# EAGLE schematic Main_DMB-4773-opto (EAGLE 6.5.0)

## Sheet 1 of 2
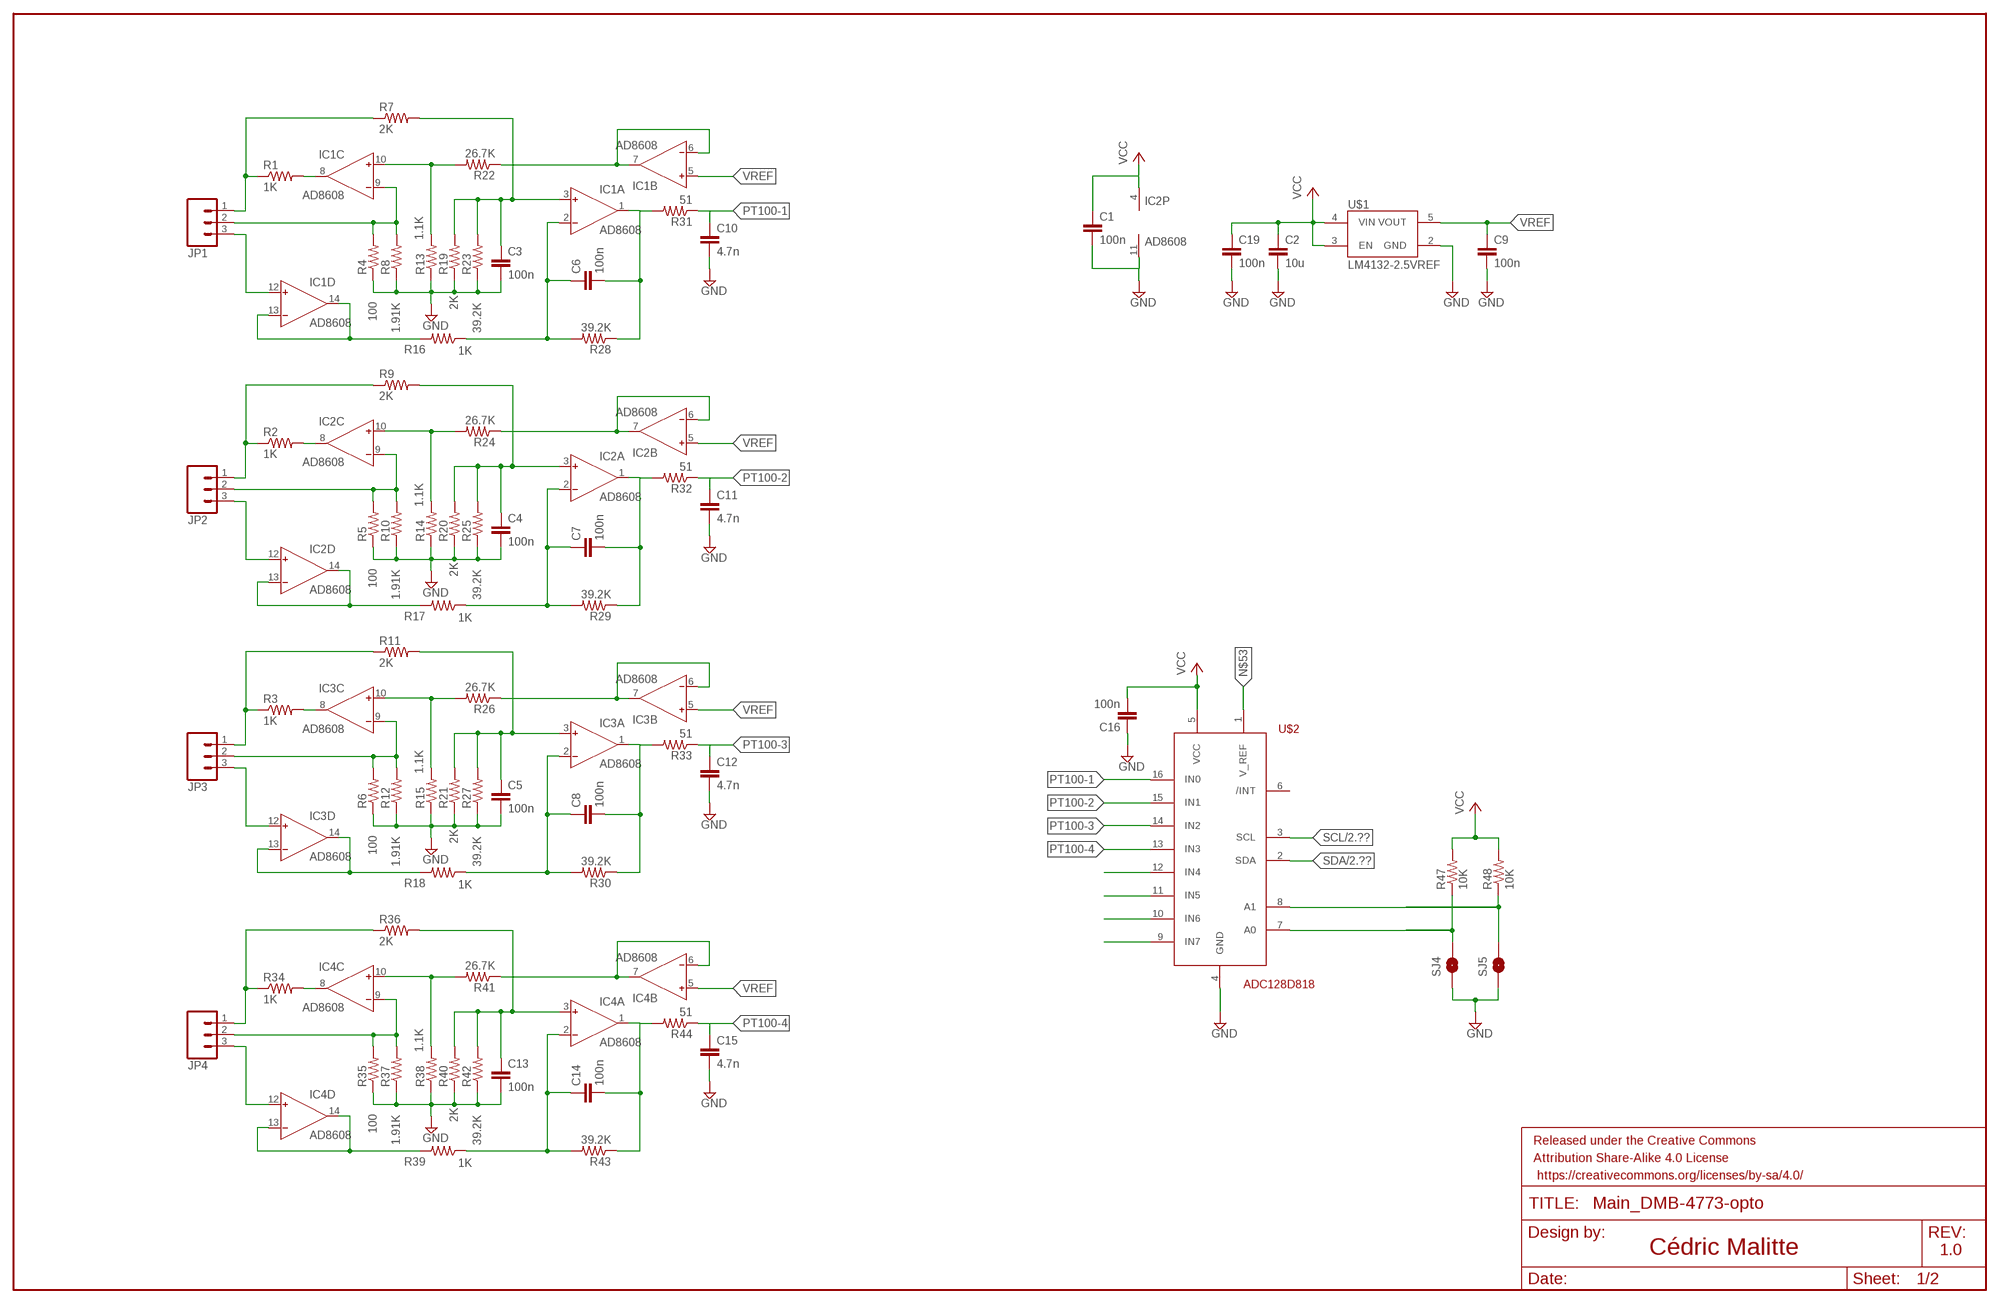
[diagram p0: schematic, sheet 1]

### Parts
C1  100n  CAP0805  [0805]
C2  10u  CAP0805  [0805]
C3  100n  CAP0805  [0805]
C4  100n  CAP0805  [0805]
C5  100n  CAP0805  [0805]
C6  100n  CAP0805  [0805]
C7  100n  CAP0805  [0805]
C8  100n  CAP0805  [0805]
C9  100n  CAP0805  [0805]
C10  4.7n  CAP0805  [0805]
C11  4.7n  CAP0805  [0805]
C12  4.7n  CAP0805  [0805]
C13  100n  CAP0805  [0805]
C14  100n  CAP0805  [0805]
C15  4.7n  CAP0805  [0805]
C16  100n  CAP0805  [0805]
C19  100n  CAP0805  [0805]
FRAME1  FRAME-LEDGER  [CREATIVE_COMMONS]
IC1  AD8608  AD8609R  [SO14]
IC2  AD8608  AD8609R  [SO14]
IC3  AD8608  AD8609R  [SO14]
IC4  AD8608  AD8609R  [SO14]
JP1  M03SCREW  [SCREWTERMINAL-3.5MM-3]
JP2  M03SCREW  [SCREWTERMINAL-3.5MM-3]
JP3  M03SCREW  [SCREWTERMINAL-3.5MM-3]
JP4  M03SCREW  [SCREWTERMINAL-3.5MM-3]
R1  1K  RESISTOR0805-RES  [0805]
R2  1K  RESISTOR0805-RES  [0805]
R3  1K  RESISTOR0805-RES  [0805]
R4  100  RESISTOR0805-RES  [0805]
R5  100  RESISTOR0805-RES  [0805]
R6  100  RESISTOR0805-RES  [0805]
R7  2K  RESISTOR0805-RES  [0805]
R8  1.91K  RESISTOR0805-RES  [0805]
R9  2K  RESISTOR0805-RES  [0805]
R10  1.91K  RESISTOR0805-RES  [0805]
R11  2K  RESISTOR0805-RES  [0805]
R12  1.91K  RESISTOR0805-RES  [0805]
R13  1.1K  RESISTOR0805-RES  [0805]
R14  1.1K  RESISTOR0805-RES  [0805]
R15  1.1K  RESISTOR0805-RES  [0805]
R16  1K  RESISTOR0805-RES  [0805]
R17  1K  RESISTOR0805-RES  [0805]
R18  1K  RESISTOR0805-RES  [0805]
R19  2K  RESISTOR0805-RES  [0805]
R20  2K  RESISTOR0805-RES  [0805]
R21  2K  RESISTOR0805-RES  [0805]
R22  26.7K  RESISTOR0805-RES  [0805]
R23  39.2K  RESISTOR0805-RES  [0805]
R24  26.7K  RESISTOR0805-RES  [0805]
R25  39.2K  RESISTOR0805-RES  [0805]
R26  26.7K  RESISTOR0805-RES  [0805]
R27  39.2K  RESISTOR0805-RES  [0805]
R28  39.2K  RESISTOR0805-RES  [0805]
R29  39.2K  RESISTOR0805-RES  [0805]
R30  39.2K  RESISTOR0805-RES  [0805]
R31  51  RESISTOR0805-RES  [0805]
R32  51  RESISTOR0805-RES  [0805]
R33  51  RESISTOR0805-RES  [0805]
R34  1K  RESISTOR0805-RES  [0805]
R35  100  RESISTOR0805-RES  [0805]
R36  2K  RESISTOR0805-RES  [0805]
R37  1.91K  RESISTOR0805-RES  [0805]
R38  1.1K  RESISTOR0805-RES  [0805]
R39  1K  RESISTOR0805-RES  [0805]
R40  2K  RESISTOR0805-RES  [0805]
R41  26.7K  RESISTOR0805-RES  [0805]
R42  39.2K  RESISTOR0805-RES  [0805]
R43  39.2K  RESISTOR0805-RES  [0805]
R44  51  RESISTOR0805-RES  [0805]
R47  10K  RESISTOR0805-RES  [0805]
R48  10K  RESISTOR0805-RES  [0805]
SJ4  SOLDERJUMPERNC  [SJ_2S]
SJ5  SOLDERJUMPERNC  [SJ_2S]
U$1  LM4132-2.5VREF  LM4128-2.5VREF  [SOT23-5]
U$2  ADC128D818  [SSOP16]

### Nets
GND: C1.2 C2.2 C3.2 C4.2 C5.2 C9.2 C10.2 C11.2 C12.2 C13.2 C15.2 C16.1 C19.2 IC2.11(P:V-) R4.1 R5.1 R6.1 R8.1 R10.1 R12.1 R13.1 R14.1 R15.1 R19.1 R20.1 R21.1 R23.1 R25.1 R27.1 R35.1 R37.1 R38.1 R40.1 R42.1 SJ4.1 SJ5.1 U$1.2(GND) U$2.4(GND) ; also sheet 2
N$1: IC2.12(D:IN+) JP2.3
N$2: IC2.13(D:IN-) IC2.14(D:OUT) R17.2
N$3: IC2.9(C:IN-) JP2.2 R5.2 R10.2
N$4: JP2.1 R2.1 R9.1
N$5: IC2.8(C:OUT) R2.2
N$6: IC3.12(D:IN+) JP3.3
N$7: IC3.13(D:IN-) IC3.14(D:OUT) R18.2
N$8: IC2.10(C:IN+) R14.2 R24.2
N$9: C4.1 IC2.3(A:IN+) R9.2 R20.2 R25.2
N$10: IC2.6(B:IN-) IC2.7(B:OUT) R24.1
N$11: IC3.9(C:IN-) JP3.2 R6.2 R12.2
N$12: JP3.1 R3.1 R11.1
N$13: C7.1 IC2.2(A:IN-) R17.1 R29.2
N$14: C7.2 IC2.1(A:OUT) R29.1 R32.2
N$15: IC3.8(C:OUT) R3.2
N$16: IC3.10(C:IN+) R15.2 R26.2
N$17: C5.1 IC3.3(A:IN+) R11.2 R21.2 R27.2
N$18: IC3.6(B:IN-) IC3.7(B:OUT) R26.1
N$19: C8.1 IC3.2(A:IN-) R18.1 R30.2
N$20: C8.2 IC3.1(A:OUT) R30.1 R33.2
N$21: IC4.12(D:IN+) JP4.3
N$22: IC4.13(D:IN-) IC4.14(D:OUT) R39.2
N$23: IC4.9(C:IN-) JP4.2 R35.2 R37.2
N$24: JP4.1 R34.1 R36.1
N$25: IC4.8(C:OUT) R34.2
N$26: IC4.10(C:IN+) R38.2 R41.2
N$27: C13.1 IC4.3(A:IN+) R36.2 R40.2 R42.2
N$28: IC4.6(B:IN-) IC4.7(B:OUT) R41.1
N$29: C14.1 IC4.2(A:IN-) R39.1 R43.2
N$30: C14.2 IC4.1(A:OUT) R43.1 R44.2
N$31: IC1.12(D:IN+) JP1.3
N$32: IC1.13(D:IN-) IC1.14(D:OUT) R16.2
N$33: IC1.9(C:IN-) JP1.2 R4.2 R8.2
N$34: JP1.1 R1.1 R7.1
N$35: IC1.8(C:OUT) R1.2
N$36: IC1.10(C:IN+) R13.2 R22.2
N$37: C3.1 IC1.3(A:IN+) R7.2 R19.2 R23.2
N$38: IC1.6(B:IN-) IC1.7(B:OUT) R22.1
N$39: C6.1 IC1.2(A:IN-) R16.1 R28.2
N$40: C6.2 IC1.1(A:OUT) R28.1 R31.2
N$45: U$2.12(IN4)
N$46: U$2.11(IN5)
N$47: U$2.10(IN6)
N$48: U$2.9(IN7)
N$51: R48.1 SJ5.2 U$2.8(A1)
N$52: R47.1 SJ4.2 U$2.7(A0)
N$53: U$2.1(V_REF)
PT100-1: C10.1 R31.1 U$2.16(IN0)
PT100-2: C11.1 R32.1 U$2.15(IN1)
PT100-3: C12.1 R33.1 U$2.14(IN2)
PT100-4: C15.1 R44.1 U$2.13(IN3)
SCL: U$2.3(SCL) ; also sheet 2
SDA: U$2.2(SDA) ; also sheet 2
VCC: C1.1 C2.1 C16.2 C19.1 IC2.4(P:V+) R47.2 R48.2 U$1.3(EN) U$1.4(VIN) U$2.5(VCC) ; also sheet 2
VREF: C9.1 IC1.5(B:IN+) IC2.5(B:IN+) IC3.5(B:IN+) IC4.5(B:IN+) U$1.5(VOUT)
Unconnected: U$2.6(/INT)

### Notes on the sheet
- Cédric Malitte | 1.0

## Sheet 2 of 2
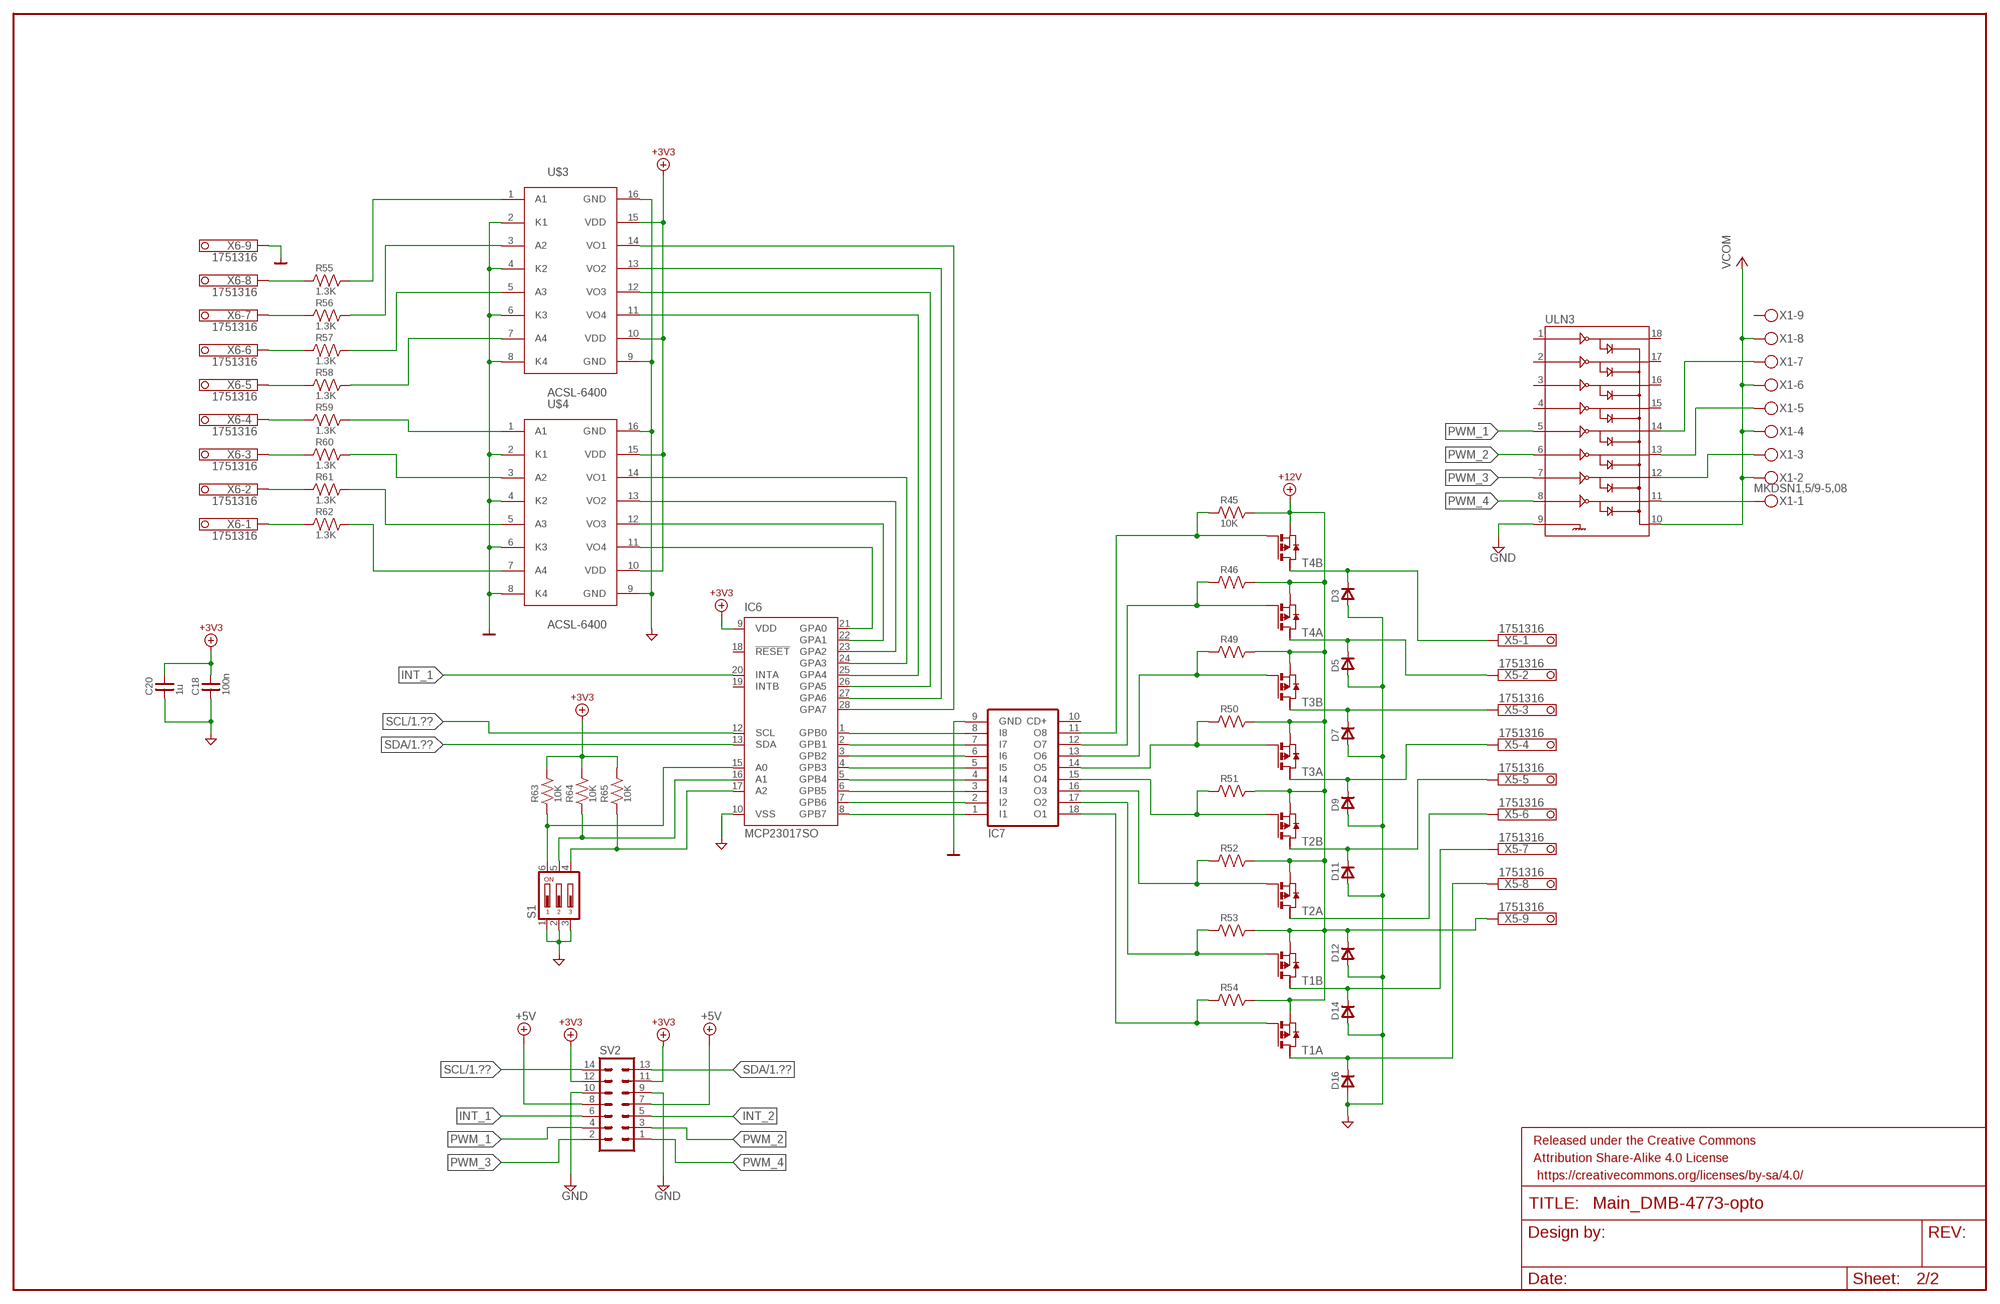
[diagram p1: schematic, sheet 2]

### Parts
C18  100n  C0805  [C0805]
C20  1u  C0805  [C0805]
D3  DSMA  [DSMA]
D5  DSMA  [DSMA]
D7  DSMA  [DSMA]
D9  DSMA  [DSMA]
D11  DSMA  [DSMA]
D12  DSMA  [DSMA]
D14  DSMA  [DSMA]
D16  DSMA  [DSMA]
FRAME3  FRAME-LEDGER  [CREATIVE_COMMONS]
IC6  MCP23017SO  [SO28W]
IC7  ULN2803A  [DIL18]
R45  10K  RU0805  [R0805]
R46  RU0805  [R0805]
R49  RU0805  [R0805]
R50  RU0805  [R0805]
R51  RU0805  [R0805]
R52  RU0805  [R0805]
R53  RU0805  [R0805]
R54  RU0805  [R0805]
R55  1.3K  RU0805  [R0805]
R56  1.3K  RU0805  [R0805]
R57  1.3K  RU0805  [R0805]
R58  1.3K  RU0805  [R0805]
R59  1.3K  RU0805  [R0805]
R60  1.3K  RU0805  [R0805]
R61  1.3K  RU0805  [R0805]
R62  1.3K  RU0805  [R0805]
R63  10K  RU0805  [R0805]
R64  10K  RU0805  [R0805]
R65  10K  RU0805  [R0805]
S1  DIP03YL  [DIP03YL]
SV2  ML14  [ML14]
T1  PMOS2SO8  [SO8]
T2  PMOS2SO8  [SO8]
T3  PMOS2SO8  [SO8]
T4  PMOS2SO8  [SO8]
U$3  ACSL-6400  [SO16]
U$4  ACSL-6400  [SO16]
ULN3  ULN2803SOIC  [SO018]
X1  MKDSN1,5/9-5,08  [MKDSN1,5/9-5,08]
X5  1751316  [1751316]
X6  1751316  [1751316]

### Nets
+3V3: C18.2 C20.2 IC6.9(VDD) R63.2 R64.2 R65.2 SV2.11 SV2.12 U$3.10(VDD) U$3.15(VDD) U$4.10(VDD) U$4.15(VDD) ; supply symbol labelled V+3V3
+5V: SV2.7 SV2.8
+12V: D12.C R45.2 R46.2 R49.2 R50.2 R51.2 R52.2 R53.2 R54.2 T1.1(A:S) T1.3(B:S) T2.1(A:S) T2.3(B:S) T3.1(A:S) T3.3(B:S) T4.1(A:S) T4.3(B:S) X5.9 ; supply symbol labelled V+12-24VV
DGND: C18.1 C20.1 D3.A D5.A D7.A D9.A D11.A D12.A D14.A D16.A IC6.10(VSS) S1.1 S1.2 S1.3 U$3.9(GND) U$3.16(GND) U$4.9(GND) U$4.16(GND) ; supply symbol labelled VDG
GND: IC7.9(GND) SV2.9 SV2.10 U$3.2(K1) U$3.4(K2) U$3.6(K3) U$3.8(K4) U$4.2(K1) U$4.4(K2) U$4.6(K3) U$4.8(K4) ULN3.9 X6.9 ; supply symbol labelled VG ; also sheet 1
INT_1: IC6.20(INTA) SV2.6
INT_2: SV2.5
N$78: IC7.16(O3) R52.1 T2.2(A:G)
N$80: IC7.11(O8) R45.1 T4.4(B:G)
N$81: IC7.12(O7) R46.1 T4.2(A:G)
N$82: IC7.13(O6) R49.1 T3.4(B:G)
N$83: IC7.14(O5) R50.1 T3.2(A:G)
N$84: IC7.15(O4) R51.1 T2.4(B:G)
N$85: IC7.17(O2) R53.1 T1.4(B:G)
N$86: IC7.18(O1) R54.1 T1.2(A:G)
N$87: IC6.1(GPB0) IC7.8(I8)
N$88: IC6.2(GPB1) IC7.7(I7)
N$89: IC6.3(GPB2) IC7.6(I6)
N$90: IC6.4(GPB3) IC7.5(I5)
N$91: IC6.5(GPB4) IC7.4(I4)
N$92: IC6.6(GPB5) IC7.3(I3)
N$93: IC6.7(GPB6) IC7.2(I2)
N$94: IC6.8(GPB7) IC7.1(I1)
N$95: D3.C T4.6(B:D) X5.1
N$96: D5.C T4.7(A:D) X5.2
N$97: D7.C T3.6(B:D) X5.3
N$98: D9.C T3.7(A:D) X5.4
N$99: D11.C T2.6(B:D) X5.5
N$100: T2.7(A:D) X5.6
N$101: D14.C T1.6(B:D) X5.7
N$102: D16.C T1.7(A:D) X5.8
N$103: R55.1 X6.8
N$104: R56.1 X6.7
N$105: R57.1 X6.6
N$106: R58.1 X6.5
N$107: R59.1 X6.4
N$108: R60.1 X6.3
N$109: R61.1 X6.2
N$110: R62.1 X6.1
N$111: R55.2 U$3.1(A1)
N$112: R56.2 U$3.3(A2)
N$113: R57.2 U$3.5(A3)
N$114: R58.2 U$3.7(A4)
N$115: R59.2 U$4.1(A1)
N$116: R60.2 U$4.3(A2)
N$117: R61.2 U$4.5(A3)
N$118: R62.2 U$4.7(A4)
N$121: IC6.21(GPA0) U$4.11(VO4)
N$122: IC6.22(GPA1) U$4.12(VO3)
N$123: IC6.23(GPA2) U$4.13(VO2)
N$124: IC6.24(GPA3) U$4.14(VO1)
N$125: IC6.25(GPA4) U$3.11(VO4)
N$127: IC6.26(GPA5) U$3.12(VO3)
N$129: IC6.27(GPA6) U$3.13(VO2)
N$131: IC6.28(GPA7) U$3.14(VO1)
N$132: IC6.17(A2) R65.1 S1.4
N$133: IC6.16(A1) R64.1 S1.5
N$134: IC6.15(A0) R63.1 S1.6
N$136: ULN3.11 X1.1
N$137: ULN3.12 X1.3
N$138: ULN3.13 X1.5
N$139: ULN3.14 X1.7
PWM_1: SV2.4 ULN3.5
PWM_2: SV2.3 ULN3.6
PWM_3: SV2.2 ULN3.7
PWM_4: SV2.1 ULN3.8
SCL: IC6.12(SCL) SV2.14 ; also sheet 1
SDA: IC6.13(SDA) SV2.13 ; also sheet 1
VCC: ULN3.10 X1.2 X1.4 X1.6 X1.8 ; supply symbol labelled VCOM ; also sheet 1
Unconnected: IC6.18(!RESET) IC6.19(INTB) IC7.10(CD+) T1.5(B:D2) T1.8(A:D2) T2.5(B:D2) T2.8(A:D2) T3.5(B:D2) T3.8(A:D2) T4.5(B:D2) T4.8(A:D2) ULN3.1 ULN3.2 ULN3.3 ULN3.4 ULN3.15 ULN3.16 ULN3.17 ULN3.18 X1.9

## Power pins joined to a net without a drawn wire
V+: IC1.4(P:V+) IC3.4(P:V+) IC4.4(P:V+)
V-: IC1.11(P:V-) IC3.11(P:V-) IC4.11(P:V-)

## Library data of the parts
C1-C16 C19 = SparkFun-Capacitors:CAP: Capacitor Standard 0603 ceramic capacitor, and 0.1" leaded capacitor.
C18 C20 = divers:C: Capacitor bipolar
D3 D5 D7 D9 D11 D12 D14 D16 = diodes:D: Diode
FRAME1 FRAME3 = SparkFun-Aesthetics:FRAME-LEDGER: Schematic Frame Standard 11x14 US Ledger frame
IC1-IC4 = analog-devices:AD8609: Precision Micropower, Low Noise CMOS, Rail-to-Rail Input/Output Operational Amplifiers Source: http://www.analog.com/static/imported-files/data_sheets/AD8603_8607_8609.pdf; MPN: AD8609ARZ; OC_FARNELL: 1581951; OC_NEWARK: 19M0976
IC6 = microchip:MCP23017: http://ww1.microchip.com/downloads/en/DeviceDoc/21952a.pdf Source: http://ww1.microchip.com/downloads/en/DeviceDoc/21952a.pdf; MF: MICROCHIP; MPN: MCP23017-E/SO; OC_FARNELL: 1332087; OC_NEWARK: 31K2958
IC7 = uln-udn:ULN2803A: DRIVER ARRAY
JP1-JP4 = SparkFun-Connectors:M03: Header 3 Standard 3-pin 0.1" header. Use with straight break away headers (SKU : PRT-00116), right angle break away headers (PRT-00553), swiss pins (PRT-00743), machine pins (PRT-00117), and female headers (PRT-00115). Molex polarized connector foot print use with SKU : PRT-08232 with associated crimp pins and housings.
R1-R44 R47 R48 = SparkFun-Passives:RESISTOR: Resistor Basic schematic elements and footprints for 0603, 1206, and PTH resistors.
R45 R46 R49-R65 = divers:RU: Resistor, US symbol
S1 = switch-dil:DIP03YL: DIL/CODE SWITCH; OC_FARNELL: unknown; OC_NEWARK: unknown
SJ4 SJ5 = SparkFun-Retired:SOLDERJUMPER: Solder Jumper Standard SMD solder jumper. Used to automate production. Two varients : Normally Open and Normally Closed are the same, but have different paste layers. NC will have a large amount of paste and should jumper during reflow.
SV2 = con-harting-ml:ML14: HARTING; OC_FARNELL: unknown; OC_NEWARK: unknown
T1-T4 = zetex:PMOS2: DUAL 30V P-CHANNEL ENHANCEMENT MODE MOSFET Source: Data sheet <http://www.diodes.com/datasheets/ZXMP3A16DN8.pdf> SOP8 Source: Data sheet <http://www.diodes.com/datasheets/ZXMD63P03X.pdf> MSOP8; OC_FARNELL: unknown; OC_NEWARK: unknown
U$1 = SparkFun-PowerIC:LM4128-2.5VREF: .1% accurate low-current voltage reference
U$2 = linear:ADC128D818
U$3 U$4 = avago:ACSL-6400
ULN3 = SparkFun-PowerIC:ULN2803: Darlington Driver ULN2803 Darlington array. 500mA max per channel, 8-channel package. Spark Fun Electronics SKU : COM-00312
X1 = con-phoenix-508:MKDSN1,5/9-5,08: MKDSN 1,5/ 9-5,08 Printklemme Nennstrom: 13,5 A Nennspannung: 250 V Rastermaß: 5,08 mm Polzahl: 9 Anschlussart: Schraubanschluss Montage: Löten Anschlussrichtung Leiter/Platine: 0 ° Artikelnummer: 1729199 Source: http://eshop.phoenixcontact.com .. 1729199.pdf; MPN: SMKDSN1,5/9-5,08; OC_FARNELL: 1792912; OC_NEWARK: 70R0305
X5 X6 = con-phoenix-350:1751316: MKDS 1/ 9-3,5 Printklemme Nennstrom: 10 A Bemessungsspannung: 160 V Raster: 3,5 mm Polzahl: 9 Montageart: Löten Anschlussart: Schraubanschluss Anschlussrichtung vom Leiter zur Platine: 0° Source: http://eshop.phoenixcontact.com .. 1751316.pdf; OC_FARNELL: unknown; OC_NEWARK: unknown